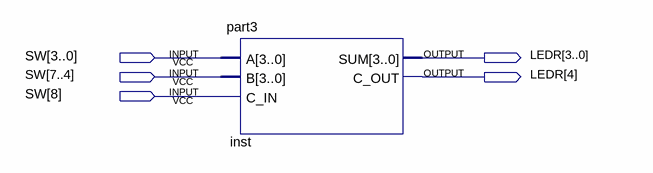
[diagram p0: schematic sheet]
// Quartus schematic part3_sch.bdf as structural Verilog: 1 symbols, 5 pins
module part3_sch (
  input  [8:0] SW,
  output [4:0] LEDR
);

  part3 inst (.A(SW[3:0]), .B(SW[7:4]), .C_IN(SW[8]), .SUM(LEDR[3:0]), .C_OUT(LEDR[4]));
endmodule
